# EasyEDA schematic Shield_Dropscreen_LED_V_0_0.json
TITLE: For EDO (DROP SCREEN exhibit, 3D exhebition); REV: 0.1; Date: 2023-12-05; Sheet: 1/1; Company: Amir BS
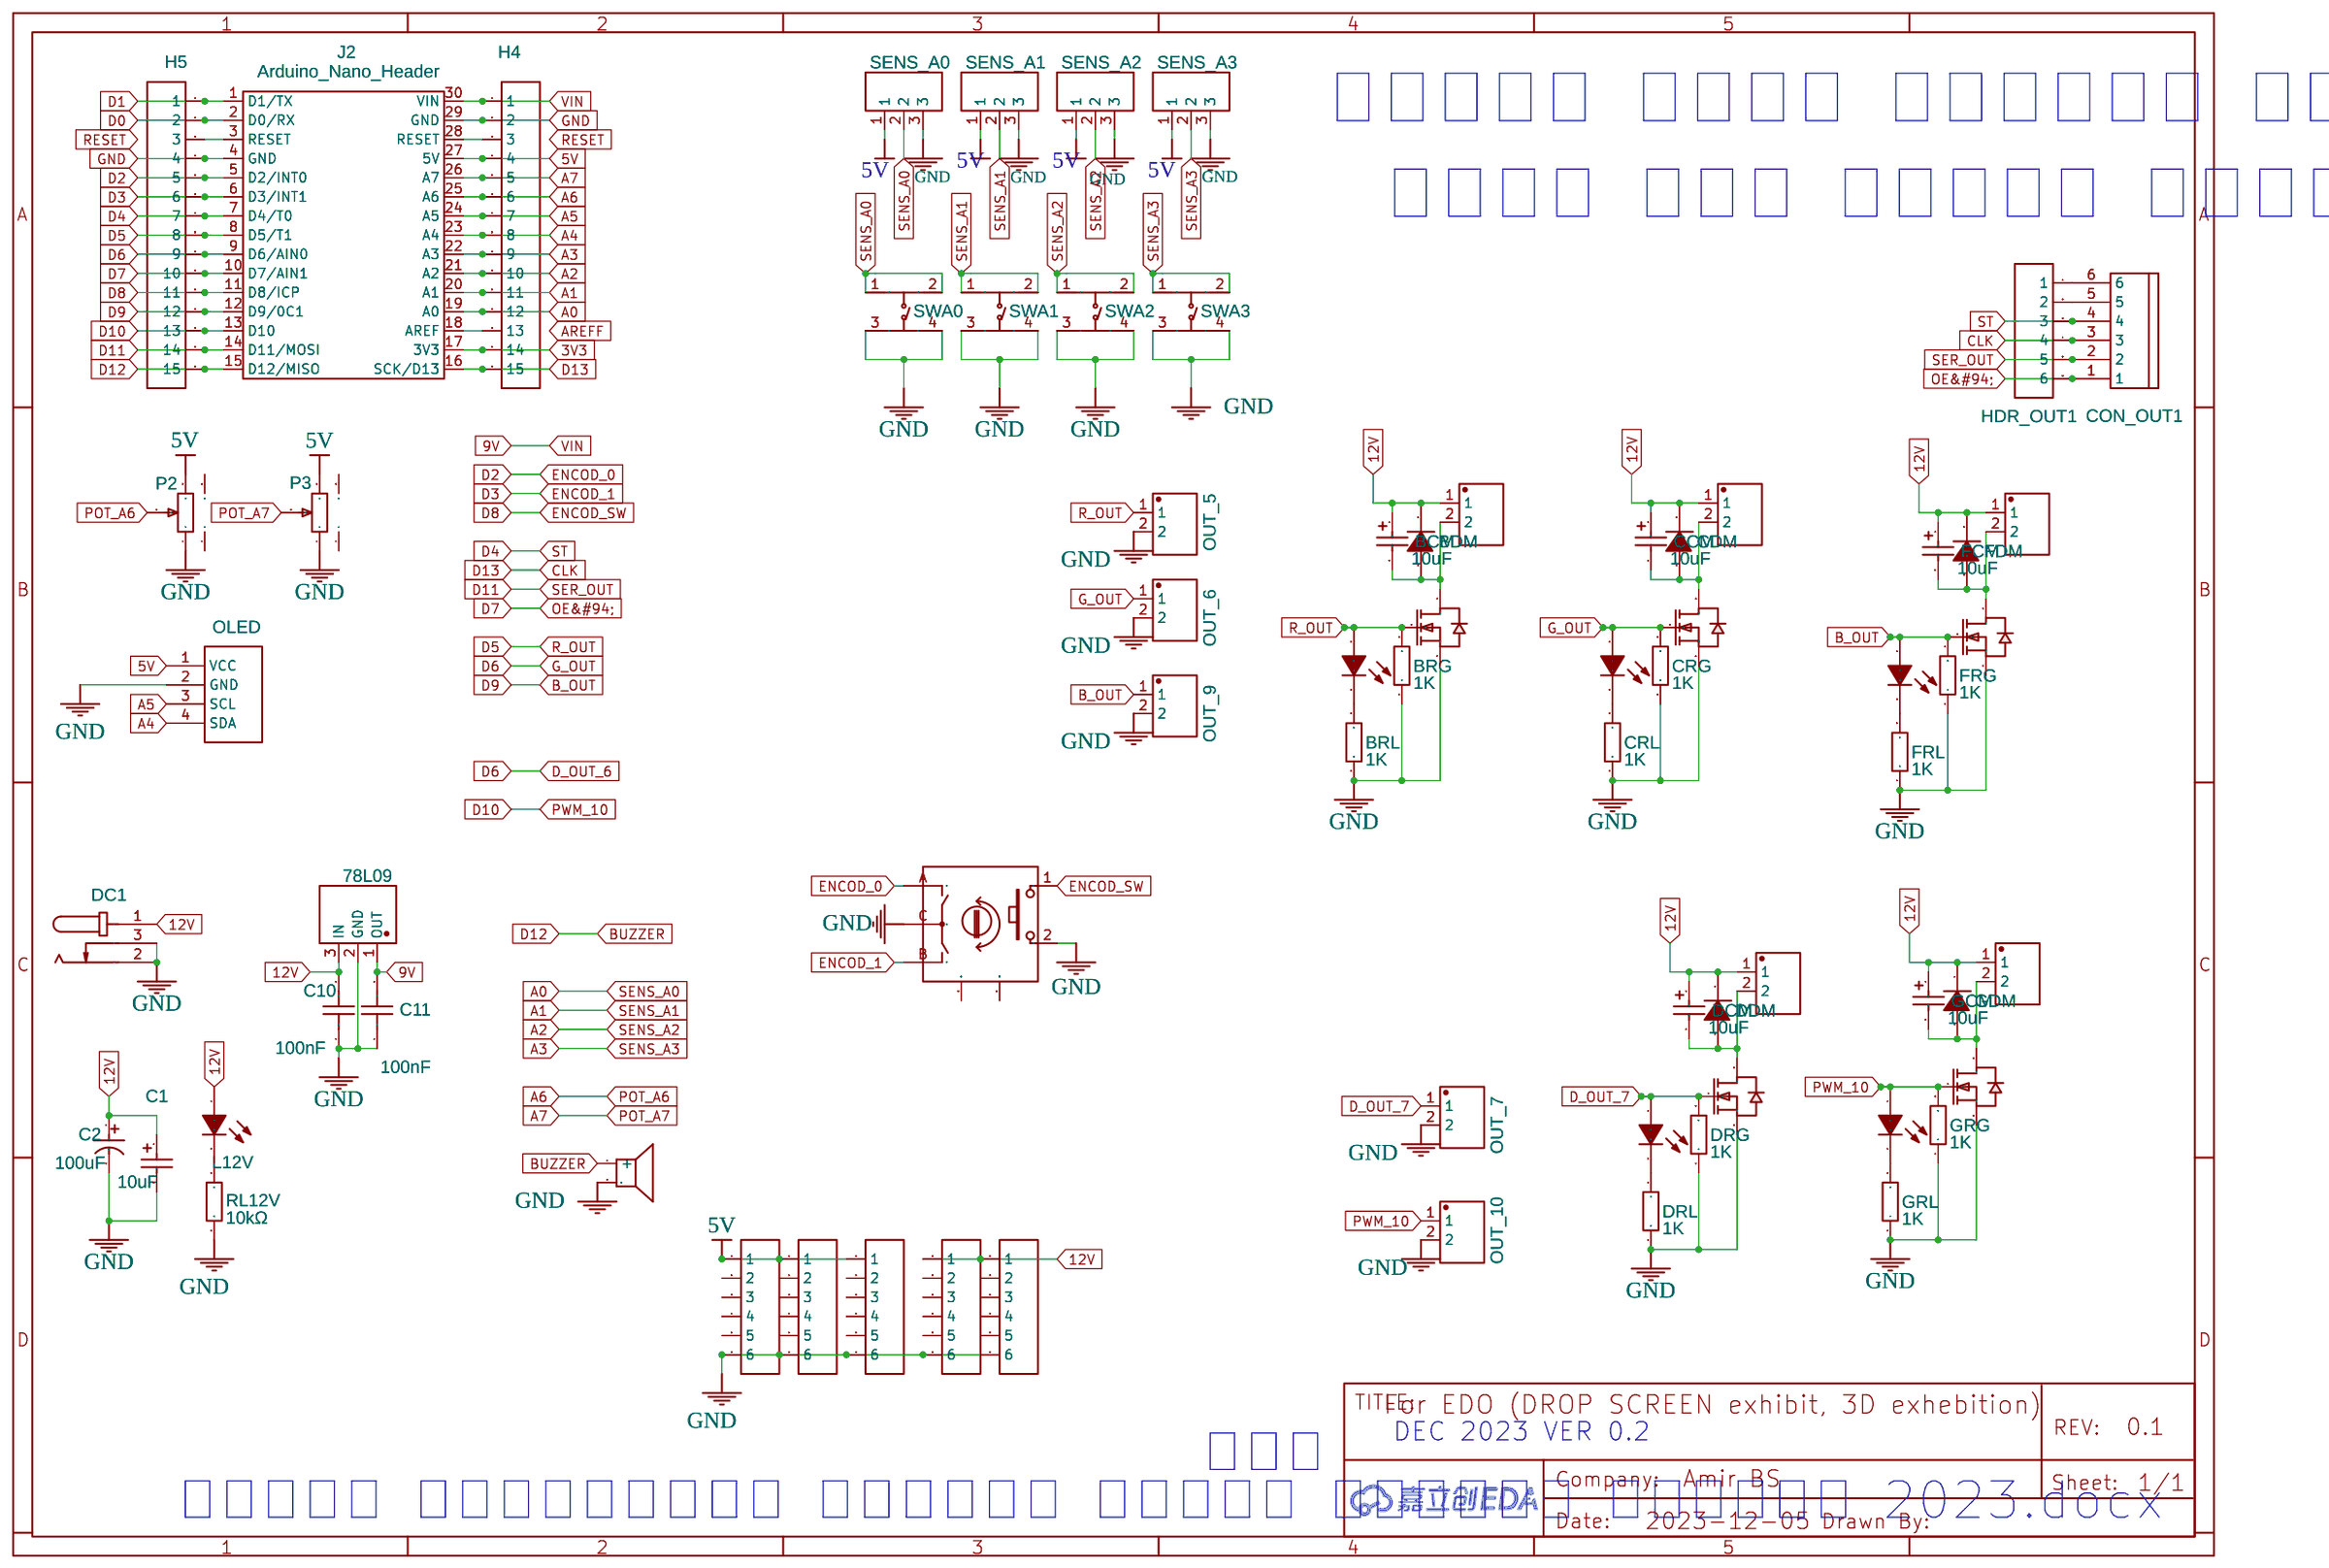
[diagram p0: schematic sheet]

## Parts
BCM  10uF  [CAP-SMD_L3.2-W1.6-RD-C7171]
BCON  KF2510-2A  [CONN-TH_KF2510-2A]
BDM  1N4007  [SMAF_L3.5-W2.6-LS4.7-RD]
BLD  LED  [LED0603-R-RD_BLUE]
BQ  Q  [SOT-23-3_L2.9-W1.3-P0.95-LS2.4-BR]
BRG  1K  [R0603]
BRL  1K  [R0603]
BUZZER1  BUZZER-12X9  [BUZ-TH_BD12.0-P7.60-D0.6-FD]
C1  10uF  [CAP-SMD_L3.2-W1.6-RD-C7171]
C2  100uF  [CAP-TH_BD6.3-P2.50-D1.0-FD]
C10  100nF  [C0603]
C11  100nF  [C0603]
CCM  10uF  [CAP-SMD_L3.2-W1.6-RD-C7171]
CCON  KF2510-2A  [CONN-TH_KF2510-2A]
CDM  1N4007  [SMAF_L3.5-W2.6-LS4.7-RD]
CLD  LED  [LED0603-R-RD_BLUE]
CON_OUT1  CON6  [CONN-TH_XH-6AW]
CQ  Q  [SOT-23-3_L2.9-W1.3-P0.95-LS2.4-BR]
CRG  1K  [R0603]
CRL  1K  [R0603]
DC1  DC  [DC-IN-TH_DC005]
DCM  10uF  [CAP-SMD_L3.2-W1.6-RD-C7171]
DCON  KF2510-2A  [CONN-TH_KF2510-2A]
DDM  1N4007  [SMAF_L3.5-W2.6-LS4.7-RD]
DLD  LED  [LED0603-R-RD_BLUE]
DQ  Q  [SOT-23-3_L2.9-W1.3-P0.95-LS2.4-BR]
DRG  1K  [R0603]
DRL  1K  [R0603]
FCM  10uF  [CAP-SMD_L3.2-W1.6-RD-C7171]
FCON  KF2510-2A  [CONN-TH_KF2510-2A]
FDM  1N4007  [SMAF_L3.5-W2.6-LS4.7-RD]
FLD  LED  [LED0603-R-RD_BLUE]
FQ  Q  [SOT-23-3_L2.9-W1.3-P0.95-LS2.4-BR]
FRG  1K  [R0603]
FRL  1K  [R0603]
GCM  10uF  [CAP-SMD_L3.2-W1.6-RD-C7171]
GCON  KF2510-2A  [CONN-TH_KF2510-2A]
GDM  1N4007  [SMAF_L3.5-W2.6-LS4.7-RD]
GLD  LED  [LED0603-R-RD_BLUE]
GQ  Q  [SOT-23-3_L2.9-W1.3-P0.95-LS2.4-BR]
GRG  1K  [R0603]
GRL  1K  [R0603]
H1  HDR-F-2.54_1x6  [HDR-F-2.54_1X6]
H2  HDR-F-2.54_1x6  [HDR-F-2.54_1X6]
H3  HDR-F-2.54_1x6  [HDR-F-2.54_1X6]
H4  HDR-F-2.54_1x15  [HDR-F-2.54_1X15]
H5  HDR-F-2.54_1x15  [HDR-F-2.54_1X15]
H6  HDR-F-2.54_1x6  [HDR-F-2.54_1X6]
H11  HDR-F-2.54_1x6  [HDR-F-2.54_1X6]
HDR_OUT1  HDR6  [HDR-M-2.54_1X6]
J2  Arduino_Nano_Header  [DIP-30_L43.18-W15.24-ARDUINONANO]
L12V  LED  [LED0603-R-RD_BLUE]
OLED  1.3 inch OLED SSH1106 I2C 128x64 copy  [1.3_OLED_SSH1106_I2C_128X64_BOARD]
OUT_5  KF2510-2A  [CONN-TH_KF2510-2A]
OUT_6  KF2510-2A  [CONN-TH_KF2510-2A]
OUT_7  KF2510-2A  [CONN-TH_KF2510-2A]
OUT_9  KF2510-2A  [CONN-TH_KF2510-2A]
OUT_10  KF2510-2A  [CONN-TH_KF2510-2A]
P2  长柄旋转电位器  [RES-ADJ-TH_RV09]
P3  长柄旋转电位器  [RES-ADJ-TH_RV09]
RL12V  10kΩ  [R0603]
SENS_A0  FK2510  [CONN-TH_3P-P2.00_KF2510_3A]
SENS_A1  FK2510  [CONN-TH_3P-P2.00_KF2510_3A]
SENS_A2  FK2510  [CONN-TH_3P-P2.00_KF2510_3A]
SENS_A3  FK2510  [CONN-TH_3P-P2.00_KF2510_3A]
SW1  PEC11R-4015F-S0024  [SW-TH_PEC11R-4XXXF-SXXXX]
SWA0  TC-6610-7-160G  [SW-TH_4P-L5.0-W5.0-P4.50-LS6.5]
SWA1  TC-6610-7-160G  [SW-TH_4P-L5.0-W5.0-P4.50-LS6.5]
SWA2  TC-6610-7-160G  [SW-TH_4P-L5.0-W5.0-P4.50-LS6.5]
SWA3  TC-6610-7-160G  [SW-TH_4P-L5.0-W5.0-P4.50-LS6.5]
U5  78L09  [SOT-89-3_L4.5-W2.5-P1.50-LS4.0-BR]

## Library data of the parts
BCM CCM DCM FCM GCM = TAJA106K016RNJ: JLCPCB Part Class: Basic Part; Package Display: No
BCON CCON DCON FCON GCON OUT_5-OUT_7 OUT_9 OUT_10 = KF2510-2A: Supplier: LCSC; Manufacturer: BOOMELE; Supplier Part: C27543; JLCPCB Part Class: Extended Part; Package Display: No
BDM CDM DDM FDM GDM = 1N4007F: Supplier: LCSC; Manufacturer: SK; Supplier Part: C110856; JLCPCB Part Class: Extended Part; Package Display: No
BLD CLD DLD FLD GLD L12V = 19-217/BHC-ZL1M2RY/3T: Supplier: LCSC; Manufacturer: EVERLIGHT; Supplier Part: C72041; JLCPCB Part Class: Basic Part; Package Display: No
BQ CQ DQ FQ GQ = JSM2302: Supplier: LCSC; Supplier Part: C5224189; Manufacturer: ElecSuper(静芯微）; Manufacturer Part: AO3400; Contributor: LCSC; JLCPCB Part Class: Extended Part; Package Display: No
BRG BRL CRG CRL DRG DRL FRG FRL GRG GRL = 0603WAF1001T5E: Supplier: LCSC; Manufacturer: UniOhm; Supplier Part: C21190; JLCPCB Part Class: Basic Part; Package Display: No
BUZZER1 = BUZZER-12X9: Contributor: lcsc; Supplier: LCSC; Supplier Part: C9900016920; Manufacturer: null; JLCPCB Part Class: Extended Part; Package Display: No
C1 = TAJA106K016RNJ: Supplier: LCSC; Manufacturer: Kyocera AVX; Supplier Part: C7171; JLCPCB Part Class: Basic Part; Package Display: No
C2 = 100uF 35V 6.3*11: Supplier: LCSC; Manufacturer: CX(承兴); Supplier Part: C19504; JLCPCB Part Class: Extended Part; Package Display: No
C10 C11 = CC0603KRX7R9BB104: JLCPCB Part Class: Basic Part; Package Display: No
CON_OUT1 = XH-6AW_C8876: Supplier: LCSC; Manufacturer: BOOMELE; Manufacturer Part: XH-6AW; Supplier Part: C8876; JLCPCB Part Class: Extended Part
DC1 = DC005-2.0MM: Supplier: LCSC; Manufacturer: SOFNG; Supplier Part: C111567; Package Display: No
H1-H3 H6 H11 = HDR-F-2.54_1x6: Supplier Part: C40877; Supplier: LCSC; Contributor: LCEDA_Lib; Package Display: No
H4 H5 = HDR-F-2.54_1x15: Supplier Part: C124408; Supplier: LCSC; Contributor: LCEDA_Lib; Package Display: No
HDR_OUT1 = HDR-M-2.54_1x6: Supplier Part: C190819; Supplier: LCSC; Contributor: LCEDA_Lib; Package Display: No
J2 = Arduino_Nano_Header
OLED = 1.3 inch OLED SSH1106 I2C 128x64 copy: Contributor: Deguello; Package Display: No
P2 P3 = 长柄旋转电位器: Supplier: LCSC; Supplier Part: C2874842; Manufacturer: null; JLCPCB Part Class: Extended Part; Contributor: LCSC; Package Display: No
RL12V = 0603WAF1002T5E: Supplier: LCSC; Manufacturer: UNI-ROYAL(厚声); Supplier Part: C25804; Resistance (Ohms): 10K; JLCPCB Part Class: Basic Part; Package Display: No
SENS_A0-SENS_A3 = kf2510_3A: JLCPCB Part Class: Extended Part; Package Display: No
SW1 = PEC11R-4015F-S0024: Contributor: LCSC; Supplier: LCSC; Supplier Part: C143789; Manufacturer: BOURNS; JLCPCB Part Class: Extended Part; Package Display: No
SWA0-SWA3 = TC-6610-7-160G: Contributor: LCSC; Supplier: LCSC; Supplier Part: C2845252; Manufacturer: HCTL(华灿天禄); JLCPCB Part Class: Extended Part; Package Display: No
U5 = 78L09U 78L09: Contributor: LCSC; Supplier: LCSC; Supplier Part: C2875177; Manufacturer: CBI(创基); JLCPCB Part Class: Extended Part; Package Display: No

## Nets
3V3: H4.14 J2.17(3V3)
5V: H1.1 H2.1 H3.1 H4.4 J2.27(5V) OLED.1(VCC) P2.3 P3.3 SENS_A0.1 SENS_A1.1 SENS_A2.1 SENS_A3.1
9V: C11.2 H4.1 J2.30(VIN) U5.1(OUT)
12V: BCM.1 BCON.1 BDM.1(C) C1.1 C2.1 C10.2 CCM.1 CCON.1 CDM.1(C) DC1.1 DCM.1 DCON.1 DDM.1(C) FCM.1 FCON.1 FDM.1(C) GCM.1 GCON.1 GDM.1(C) H6.1 H11.1 L12V.1(A) U5.3(IN)
GND: BQ.2(S) BRG.1 BRL.1 BUZZER1.2 C1.2 C2.2 C10.1 C11.1 CQ.2(S) CRG.1 CRL.1 DC1.2 DC1.3 DQ.2(S) DRG.1 DRL.1 FQ.2(S) FRG.1 FRL.1 GQ.2(S) GRG.1 GRL.1 H1.6 H2.6 H3.6 H4.2 H5.4 H6.6 H11.6 J2.4(GND) J2.29(GND) OLED.2(GND) OUT_5.2 OUT_6.2 OUT_7.2 OUT_9.2 OUT_10.2 P2.1 P3.1 RL12V.2 SENS_A0.3 SENS_A1.3 SENS_A2.3 SENS_A3.3 SW1.2 SW1.C SWA0.3 SWA0.4 SWA1.3 SWA1.4 SWA2.3 SWA2.4 SWA3.3 SWA3.4 U5.2(GND)
A0: H4.12 J2.19(A0) SENS_A0.2 SWA0.1 SWA0.2
A1: H4.11 J2.20(A1) SENS_A1.2 SWA1.1 SWA1.2
A2: H4.10 J2.21(A2) SENS_A2.2 SWA2.1 SWA2.2
A3: H4.9 J2.22(A3) SENS_A3.2 SWA3.1 SWA3.2
A4: H4.8 J2.23(A4) OLED.4(SDA)
A5: H4.7 J2.24(A5) OLED.3(SCL)
A6: H4.6 J2.25(A6) P2.2
A7: H4.5 J2.26(A7) P3.2
B_OUT: FLD.1(A) FQ.1(G) FRG.2 H5.12 J2.12(D9/0C1) OUT_9.1
BUZZER: BUZZER1.1(+) H5.15 J2.15(D12/MISO)
CLK: CON_OUT1.3 H4.15 HDR_OUT1.4 J2.16(SCK/D13)
D0: H5.2 J2.2(D0/RX)
D1: H5.1 J2.1(D1/TX)
D2: H5.5 J2.5(D2/INT0) SW1.A
D3: H5.6 J2.6(D3/INT1) SW1.B
D4: CON_OUT1.4 H5.7 HDR_OUT1.3 J2.7(D4/T0)
D5: BLD.1(A) BQ.1(G) BRG.2 H5.8 J2.8(D5/T1) OUT_5.1
D6: CLD.1(A) CQ.1(G) CRG.2 H5.9 J2.9(D6/AIN0) OUT_6.1
D7: CON_OUT1.1 H5.10 HDR_OUT1.6 J2.10(D7/AIN1)
D8: H5.11 J2.11(D8/ICP) SW1.1
D10: GLD.1(A) GQ.1(G) GRG.2 H5.13 J2.13(D10) OUT_10.1
D11: CON_OUT1.2 H5.14 HDR_OUT1.5 J2.14(D11/MOSI)
D_OUT_7: DLD.1(A) DQ.1(G) DRG.2 OUT_7.1
Net-(BCM-2): BCM.2 BCON.2 BDM.2(A) BQ.3(D)
Net-(BLD-2): BLD.2(C) BRL.2
Net-(CCM-2): CCM.2 CCON.2 CDM.2(A) CQ.3(D)
Net-(CLD-2): CLD.2(C) CRL.2
Net-(CON_OUT1-5): CON_OUT1.5 HDR_OUT1.2
Net-(CON_OUT1-6): CON_OUT1.6 HDR_OUT1.1
Net-(DCM-2): DCM.2 DCON.2 DDM.2(A) DQ.3(D)
Net-(DLD-2): DLD.2(C) DRL.2
Net-(FCM-2): FCM.2 FCON.2 FDM.2(A) FQ.3(D)
Net-(FLD-2): FLD.2(C) FRL.2
Net-(GCM-2): GCM.2 GCON.2 GDM.2(A) GQ.3(D)
Net-(GLD-2): GLD.2(C) GRL.2
Net-(H4-3): H4.3 J2.28(RESET)
Net-(H4-13): H4.13 J2.18(AREF)
Net-(H5-3): H5.3 J2.3(RESET)
Net-(L12V-2): L12V.2(C) RL12V.1

Not connected (* = marked no-connect by the designer): H1 2 3 4 5; H2 2 3 4 5; H3 2 3 4 5; H6 2 3 4 5; H11 2 3 4 5; P2 4 5; P3 4 5; SW1 MT1 MT2

## Notes on the sheet
- פיקוד לדים וקסטות ברזים אמיתי
- מוצג מסך טיפות החופש ליצור
- DEC 2023 VER 0.2
- ראה
- כרטיס לארדווינו לפיקוד טיפות ותאורה פברואר 2023.docx
